# Altium schematic sheet power.SchDoc
size A4
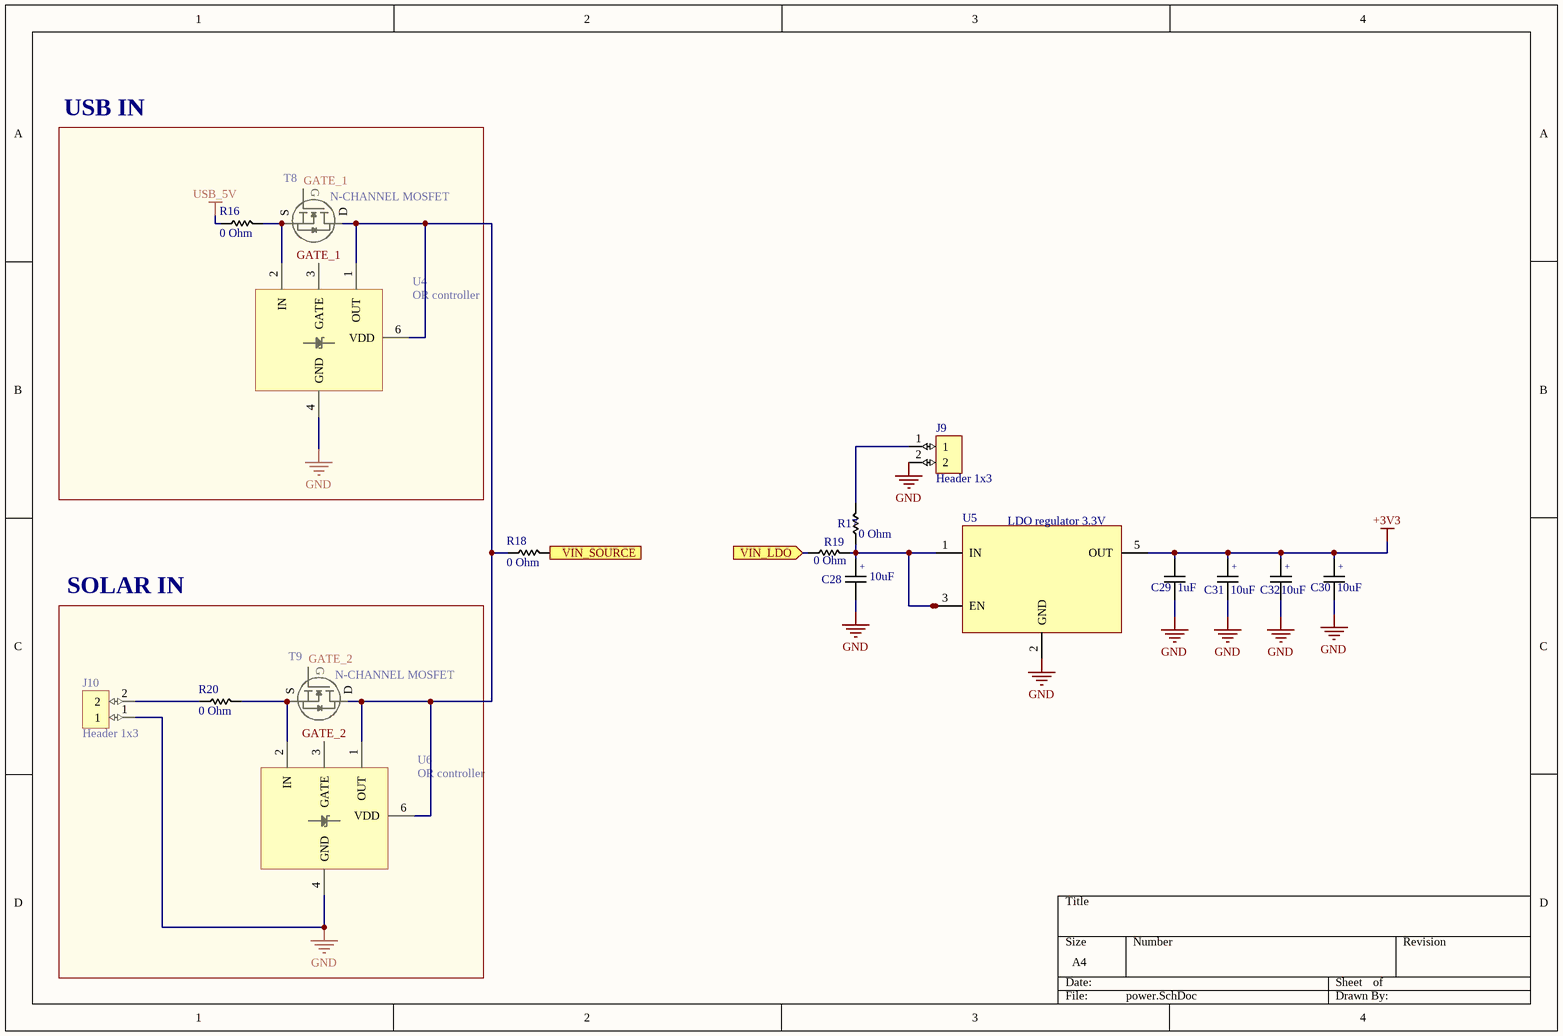
[diagram p0: power.SchDoc]

## Parts
C28  value 10uF  [Capacitor electrolytic SMD 4x5.4]  (hidden comment: El. Capacitor SMD 4x5.4)
C29  value 1uF  [C0603]  (hidden comment: Capacitor 0603)
C30  value 10uF  [Capacitor electrolytic SMD 4x5.4]  (hidden comment: El. Capacitor SMD 4x5.4)
C31  value 10uF  [Capacitor electrolytic SMD 4x5.4]  (hidden comment: El. Capacitor SMD 4x5.4)
C32  value 10uF  [Capacitor electrolytic SMD 4x5.4]  (hidden comment: El. Capacitor SMD 4x5.4)
J9  Header 1x3  [HEADER 1X2 MALE JST]
J10  Header 1x3  [Header 1x2 Male]
R16  value 0 Ohm  [R0603]  (hidden comment: Resistor 0603)
R17  value 0 Ohm  [R0603]  (hidden comment: Resistor 0603)
R18  value 0 Ohm  [R0603]  (hidden comment: Resistor 0603)
R19  value 0 Ohm  [R0603]  (hidden comment: Resistor 0603)
R20  value 0 Ohm  [R0603]  (hidden comment: Resistor 0603)
T8  N-CHANNEL MOSFET  [N-CHANNEL MOSFET]
T9  N-CHANNEL MOSFET  [N-CHANNEL MOSFET]
U4  OR controller  [DFN 6-pins]
U5  LDO regulator 3.3V  [LDO 5-pin SOT]
U6  OR controller  [DFN 6-pins]

## Blocks framed on the sheet
USB IN: R16 T8 U4
SOLAR IN: J10 R20 T9 U6

## Ports
VIN_LDO (in), VIN_SOURCE (out)

## Nets
+3V3: C29.2 C30.1 C31.1 C32.1 U5.5(OUT)
GND: C28.2 C29.1 C30.2 C31.2 C32.2 J9.2 J10.1 U4.4(GND) U5.2(GND) U6.4(GND)
USB_5V: R16.1
GATE_1: T8.1(G) U4.3(GATE)
GATE_2: T9.1(G) U6.3(GATE)
VIN_LDO: R19.1 ; port VIN_LDO
VIN_SOURCE: R18.2 ; port VIN_SOURCE
NetC28_1: C28.1 R17.1 R19.2 U5.1(IN) U5.3(EN)
NetJ9_1: J9.1 R17.2
NetJ10_2: J10.2 R20.1
NetR16_2: R16.2 T8.2(S) U4.2(IN)
NetR18_1: R18.1 T8.3(D) T9.3(D) U4.1(OUT) U4.6(VDD) U6.1(OUT) U6.6(VDD)
NetR20_2: R20.2 T9.2(S) U6.2(IN)

## Notes on the sheet
- (in symbol El. Capacitor SMD 4x5.4) +

## Library data of the parts
J9 J10 = Header 1x2 Male
U4 U6 = OR controller: LTC4357
U5 = TLV700 - 3.3V